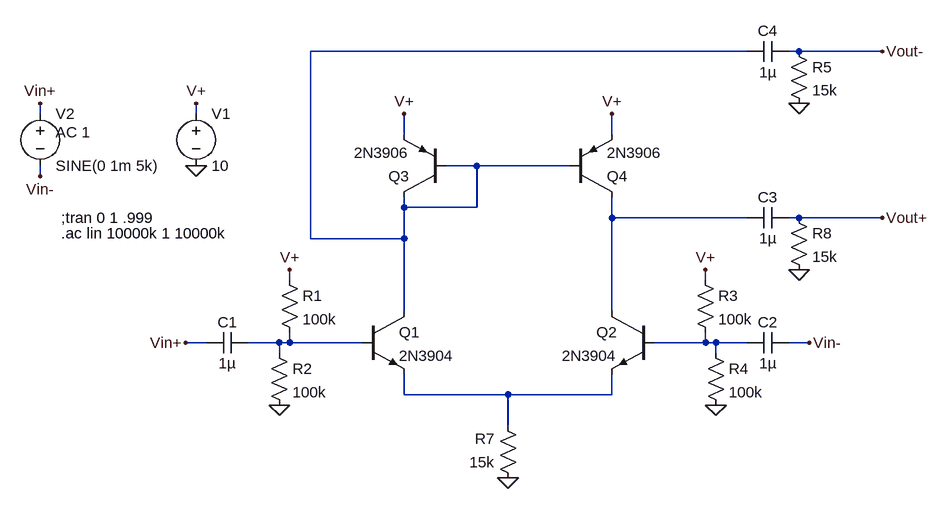
[diagram p0: schematic 04B-359.asc]
04B-359.asc, the LTspice schematic file:
Version 4
SHEET 1 1080 680
WIRE 784 -192 112 -192
WIRE 864 -192 848 -192
WIRE 992 -192 864 -192
WIRE -304 -96 -304 -112
WIRE -64 -96 -64 -112
WIRE 256 -64 256 -96
WIRE 576 -64 576 -96
WIRE 368 -16 320 -16
WIRE 512 -16 368 -16
WIRE -304 0 -304 -16
WIRE 256 48 256 32
WIRE 368 48 368 -16
WIRE 368 48 256 48
WIRE 576 64 576 32
WIRE 784 64 576 64
WIRE 864 64 848 64
WIRE 992 64 864 64
WIRE 112 96 112 -192
WIRE 256 96 256 48
WIRE 256 96 112 96
WIRE 80 160 80 144
WIRE 720 160 720 144
WIRE 256 208 256 96
WIRE 576 208 576 64
WIRE -48 256 -80 256
WIRE 64 256 16 256
WIRE 80 256 80 240
WIRE 80 256 64 256
WIRE 192 256 80 256
WIRE 720 256 720 240
WIRE 720 256 640 256
WIRE 736 256 720 256
WIRE 784 256 736 256
WIRE 880 256 848 256
WIRE 64 272 64 256
WIRE 736 272 736 256
WIRE 256 336 256 304
WIRE 416 336 256 336
WIRE 576 336 576 304
WIRE 576 336 416 336
WIRE 416 384 416 336
FLAG 64 352 0
FLAG 416 464 0
FLAG 736 352 0
FLAG 80 144 V+
FLAG 256 -96 V+
FLAG 576 -96 V+
FLAG 720 144 V+
FLAG 880 256 Vin-
FLAG -80 256 Vin+
FLAG 864 144 0
FLAG 992 64 Vout+
FLAG -64 -16 0
FLAG -64 -112 V+
FLAG -304 -112 Vin+
FLAG -304 0 Vin-
FLAG 864 -112 0
FLAG 992 -192 Vout-
SYMBOL npn 192 208 R0
SYMATTR InstName Q1
SYMATTR Value 2N3904
SYMBOL npn 640 208 M0
SYMATTR InstName Q2
SYMATTR Value 2N3904
SYMBOL pnp 320 32 R180
SYMATTR InstName Q3
SYMATTR Value 2N3906
SYMBOL pnp 512 32 M180
SYMATTR InstName Q4
SYMATTR Value 2N3906
SYMBOL res 64 144 R0
SYMATTR InstName R1
SYMATTR Value 100k
SYMBOL res 48 256 R0
SYMATTR InstName R2
SYMATTR Value 100k
SYMBOL res 704 144 R0
SYMATTR InstName R3
SYMATTR Value 100k
SYMBOL res 720 256 R0
SYMATTR InstName R4
SYMATTR Value 100k
SYMBOL res 432 480 R180
WINDOW 0 36 76 Left 2
WINDOW 3 36 40 Left 2
SYMATTR InstName R7
SYMATTR Value 15k
SYMBOL cap 16 240 R90
WINDOW 0 0 32 VBottom 2
WINDOW 3 32 32 VTop 2
SYMATTR InstName C1
SYMATTR Value 1µ
SYMBOL cap 848 240 R90
WINDOW 0 0 32 VBottom 2
WINDOW 3 32 32 VTop 2
SYMATTR InstName C2
SYMATTR Value 1µ
SYMBOL cap 848 48 R90
WINDOW 0 0 32 VBottom 2
WINDOW 3 32 32 VTop 2
SYMATTR InstName C3
SYMATTR Value 1µ
SYMBOL res 848 48 R0
SYMATTR InstName R8
SYMATTR Value 15k
SYMBOL voltage -64 -112 R0
WINDOW 123 0 0 Left 0
WINDOW 39 0 0 Left 0
SYMATTR InstName V1
SYMATTR Value 10
SYMBOL voltage -304 -112 R0
WINDOW 123 24 44 Left 2
WINDOW 39 0 0 Left 0
SYMATTR Value2 AC 1
SYMATTR InstName V2
SYMATTR Value SINE(0 1m 5k)
SYMBOL res 848 -208 R0
SYMATTR InstName R5
SYMATTR Value 15k
SYMBOL cap 848 -208 R90
WINDOW 0 0 32 VBottom 2
WINDOW 3 32 32 VTop 2
SYMATTR InstName C4
SYMATTR Value 1µ
TEXT -272 64 Left 2 !;tran 0 1 .999
TEXT -272 88 Left 2 !.ac lin 10000k 1 10000k

The netlist it stands for:
* 04B-359.asc
Q1 N001 N003 N005 0 2N3904
Q2 N002 N004 N005 0 2N3904
Q3 N001 N001 V+ 0 2N3906
Q4 N002 N001 V+ 0 2N3906
R1 V+ N003 100k
R2 N003 0 100k
R3 V+ N004 100k
R4 N004 0 100k
R7 0 N005 15k
C1 N003 Vin+ 1µ
C2 Vin- N004 1µ
C3 Vout+ N002 1µ
R8 Vout+ 0 15k
V1 V+ 0 10
V2 Vin+ Vin- SINE(0 1m 5k) AC 1
R5 Vout- 0 15k
C4 Vout- N001 1µ
.model NPN NPN
.model PNP PNP
.lib standard.bjt
;tran 0 1 .999
.ac lin 10000k 1 10000k
.backanno
.end